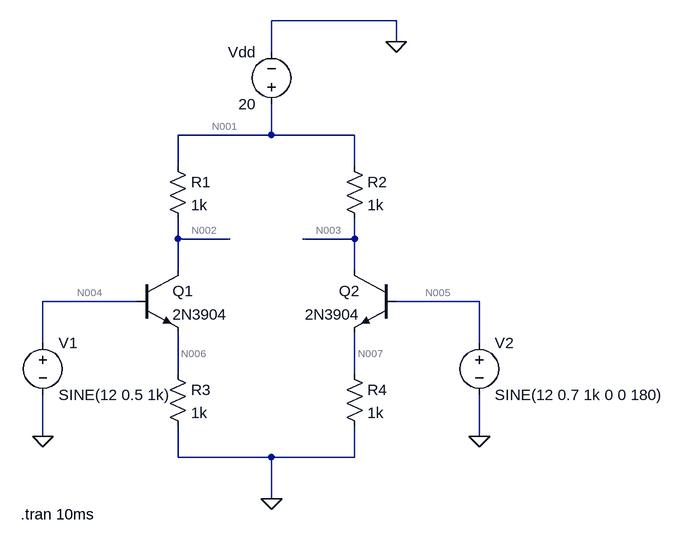
[diagram p0: schematic Draft1.asc]
Draft1.asc, the LTspice schematic file:
Version 4
SHEET 1 880 680
WIRE 16 -288 -176 -288
WIRE 16 -256 16 -288
WIRE -176 -240 -176 -288
WIRE -176 -112 -176 -160
WIRE -176 -112 -320 -112
WIRE -48 -112 -176 -112
WIRE -320 -64 -320 -112
WIRE -48 -64 -48 -112
WIRE -320 48 -320 16
WIRE -240 48 -320 48
WIRE -48 48 -48 16
WIRE -48 48 -128 48
WIRE -320 96 -320 48
WIRE -48 96 -48 48
WIRE -384 144 -528 144
WIRE 144 144 16 144
WIRE -528 208 -528 144
WIRE 144 208 144 144
WIRE -320 256 -320 192
WIRE -48 256 -48 192
WIRE -528 352 -528 288
WIRE 144 352 144 288
WIRE -320 384 -320 336
WIRE -176 384 -320 384
WIRE -48 384 -48 336
WIRE -48 384 -176 384
WIRE -176 448 -176 384
FLAG -176 448 0
FLAG 16 -256 0
FLAG -528 352 0
FLAG 144 352 0
SYMBOL npn -384 96 R0
SYMATTR InstName Q1
SYMATTR Value 2N3904
SYMBOL npn 16 96 M0
SYMATTR InstName Q2
SYMATTR Value 2N3904
SYMBOL res -336 -80 R0
SYMATTR InstName R1
SYMATTR Value 1k
SYMBOL res -64 -80 R0
SYMATTR InstName R2
SYMATTR Value 1k
SYMBOL res -336 240 R0
SYMATTR InstName R3
SYMATTR Value 1k
SYMBOL res -64 240 R0
SYMATTR InstName R4
SYMATTR Value 1k
SYMBOL voltage -528 192 R0
WINDOW 123 0 0 Left 0
WINDOW 39 0 0 Left 0
SYMATTR InstName V1
SYMATTR Value SINE(12 0.5 1k)
SYMBOL voltage 144 192 R0
WINDOW 123 0 0 Left 0
WINDOW 39 0 0 Left 0
SYMATTR InstName V2
SYMATTR Value SINE(12 0.7 1k 0 0 180)
SYMBOL voltage -176 -144 R180
WINDOW 0 24 96 Left 2
WINDOW 3 24 16 Left 2
WINDOW 123 0 0 Left 0
WINDOW 39 0 0 Left 0
SYMATTR InstName Vdd
SYMATTR Value 20
TEXT -562 472 Left 2 !.tran 10ms

The netlist it stands for:
* Draft1.asc
Q1 N002 N004 N006 0 2N3904
Q2 N003 N005 N007 0 2N3904
R1 N001 N002 1k
R2 N001 N003 1k
R3 N006 0 1k
R4 N007 0 1k
V1 N004 0 SINE(12 0.5 1k)
V2 N005 0 SINE(12 0.7 1k 0 0 180)
Vdd N001 0 20
.model NPN NPN
.model PNP PNP
.lib standard.bjt
.tran 10ms
.backanno
.end

* Results of the author's LTspice run, read from the files saved beside the schematic
* Operating Point, zero values left out:
*   V(n002) = 11.24 V
*   V(n004) = 12 V
*   V(n006) = 11.22 V
*   V(n003) = 11.24 V
*   V(n005) = 12 V
*   V(n007) = 11.22 V
*   V(n001) = 20 V
*   Ic(Q2) = 8.762 mA
*   Ib(Q2) = 2.454 mA
*   Ie(Q2) = -11.22 mA
*   Ic(Q1) = 8.762 mA
*   Ib(Q1) = 2.454 mA
*   Ie(Q1) = -11.22 mA
*   I(R4) = 11.22 mA
*   I(R3) = 11.22 mA
*   I(R2) = 8.762 mA
*   I(R1) = 8.762 mA
*   I(Vdd) = -17.52 mA
*   I(V2) = -2.454 mA
*   I(V1) = -2.454 mA
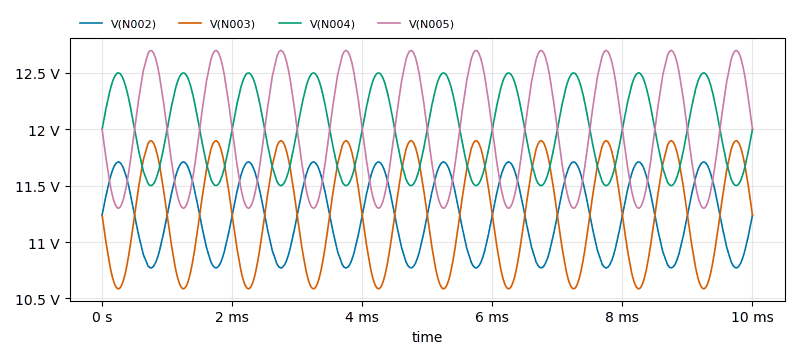
[diagram p1: Transient Analysis of Draft1.asc, plotted from the saved traces]
* Transient Analysis, 1 run:
*   V(N002): min 10.77 V, max 11.71 V, average 11.24 V, rms 11.25 V, last 11.24 V
*   V(N003): min 10.59 V, max 11.9 V, average 11.24 V, rms 11.25 V, last 11.24 V
*   V(N004): min 11.5 V, max 12.5 V, average 12 V, rms 12.01 V, last 12 V
*   V(N005): min 11.3 V, max 12.7 V, average 12 V, rms 12.01 V, last 12 V